# Altium schematic sheet Crystal_32.768kHz.SchDoc: Crystal 32.768KHz
size A4
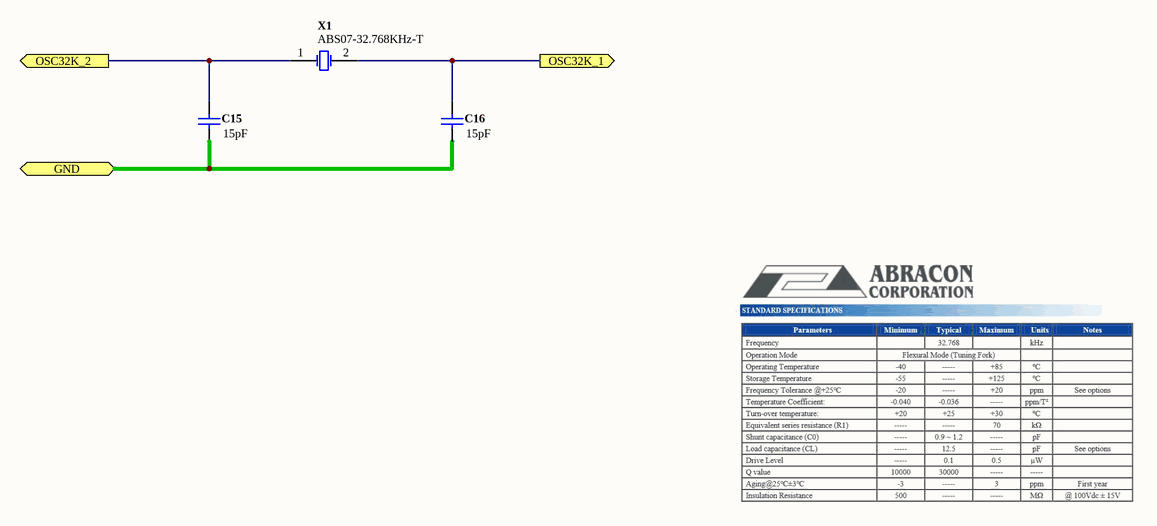
[diagram p0: Crystal_32.768kHz.SchDoc]

## Parts
C15  value 15pF  [CAPC0402(1005)60_L]  (hidden comment: CAP 15pF 16V 0402(1005))
C16  value 15pF  [CAPC0402(1005)60_L]  (hidden comment: CAP 15pF 16V 0402(1005))
X1  ABS07-32.768KHz-T  [ABRA-ABS07-2_V]

## Ports
GND, OSC32K_1 (out), OSC32K_2 (out)

## Nets
GND: C15.1 C16.1 ; port GND
OSC32K_1: C16.2 X1.2(X2) ; port OSC32K_1
OSC32K_2: C15.2 X1.1(X1) ; port OSC32K_2

## Notes on the sheet
- Sheet Title
- Project Title
- Size:
- Date:
- A4
- Item:
- Time:
- Revision:
- Sheet
- of
- File:

## Library data of the parts
C15 C16 = CMP-1034-00800-1: CAP 15pF 16V ±1% 0402 (1005 Metric) Thickness 0.6mm SMD; Case-Metric: 1005; Case-EIA: 0402; Tolerance: ±1%; Rated Voltage: 16 V; Technology: SMT; Max Thickness: 0.6 mm
X1 = CMP-0447-00001-1: Crystal, 32.768 kHz, 12.5 pF, -40 to 85 degC, SMD Low Profile 3.2 x 1.5 x 0.9 mm, Tape and Reel; Manufacturer: Abracon; Drive Level (Type): 0.1 uW; Operation Mode: Flexural Mode (Tuning Fork); Shunt Capacitance (C0): 0.9 to 1.2 pF; Equivalent Series Resistance (R1): 70 Kohm; Insulation Resistance (Min): 500 Mohm; Q Value (Type): 30000; Frequency Tolerance @+25degC: +/- 20 ppm; Load Capacitance (CL): 12.5 pF; Operating Temperature: -40 to 85 degC; PartNumber: ABS07-32.768KHz-T; ComponentLink3Description: Package Specification; DatasheetVersion: 04.03.13; Mounting Technology: Surface Mount; Frequency: 32.768 kHz; ComponentLink1URL: http://www.abracon.com/; Packing: Tape and Reel; ComponentLink3URL: http://www.abracon.com/Resonators/ABS07.pdf; ComponentLink2Description: Datasheet; PackageDescription: 2-Pin Hand Drawn, Body 3.2x1.5mm, Pitch 2.5mm; ComponentLink1Description: Manufacturer URL; PackageReference: ABS07-2; ComponentLink2URL: http://www.abracon.com/Resonators/ABS07.pdf